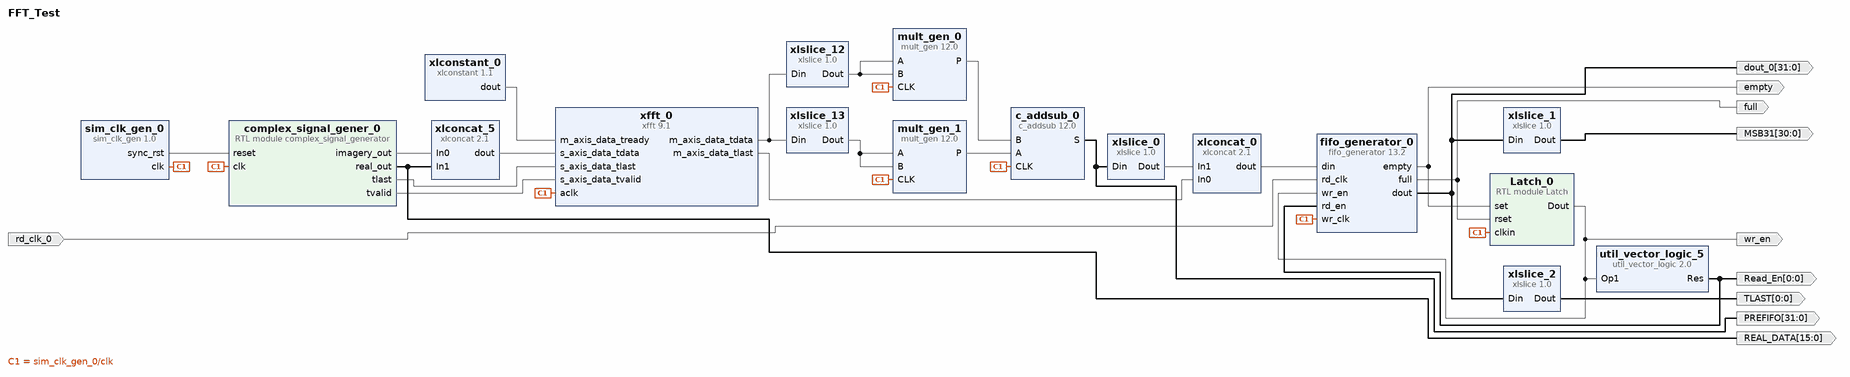
[diagram p0: block diagram of the top level]
# Vivado block design FFT_Test, xczu3eg-sfvc784-1-e, Vivado 2023.1
create_bd_design FFT_Test

create_bd_port -dir O -from 15 -to 0 REAL_DATA
create_bd_port -dir O -from 31 -to 0 dout_0
create_bd_port -dir O -from 0 -to 0 Read_En
create_bd_port -dir O wr_en
create_bd_port -dir O full
create_bd_port -dir O -from 31 -to 0 -type data PREFIFO
create_bd_port -dir O empty
create_bd_port -dir I -type clk rd_clk_0
create_bd_port -dir O -from 30 -to 0 MSB31
create_bd_port -dir O -from 0 -to 0 TLAST

create_bd_cell -type ip -vlnv xilinx.com:ip:c_addsub:12.0 c_addsub_0
set_property -dict [list \
  CONFIG.A_Type Signed \
  CONFIG.A_Width 32 \
  CONFIG.B_Type Signed \
  CONFIG.B_Value 00000000000000000000000000000000 \
  CONFIG.B_Width 32 \
  CONFIG.CE false \
  CONFIG.Latency 1 \
  CONFIG.Out_Width 32 \
] [get_bd_cells c_addsub_0]
create_bd_cell -type module -reference complex_signal_generator complex_signal_gener_0
set_property -dict {CONFIG.FFT_Size 2048 CONFIG.FUNC_TYPE 1} [get_bd_cells complex_signal_gener_0]
create_bd_cell -type ip -vlnv xilinx.com:ip:mult_gen:12.0 mult_gen_0
set_property -dict [list \
  CONFIG.PortAType Signed \
  CONFIG.PortAWidth 16 \
  CONFIG.PortBType Signed \
  CONFIG.PortBWidth 16 \
] [get_bd_cells mult_gen_0]
create_bd_cell -type ip -vlnv xilinx.com:ip:mult_gen:12.0 mult_gen_1
set_property -dict [list \
  CONFIG.PortAType Signed \
  CONFIG.PortAWidth 16 \
  CONFIG.PortBType Signed \
  CONFIG.PortBWidth 16 \
] [get_bd_cells mult_gen_1]
create_bd_cell -type ip -vlnv xilinx.com:ip:sim_clk_gen:1.0 sim_clk_gen_0
create_bd_cell -type ip -vlnv xilinx.com:ip:xfft:9.1 xfft_0
set_property -dict [list \
  CONFIG.channels 1 \
  CONFIG.implementation_options automatically_select \
  CONFIG.input_width 16 \
  CONFIG.number_of_stages_using_block_ram_for_data_and_phase_factors 4 \
  CONFIG.output_ordering natural_order \
  CONFIG.phase_factor_width 16 \
  CONFIG.scaling_options scaled \
  CONFIG.target_clock_frequency 100 \
  CONFIG.target_data_throughput 100 \
  CONFIG.transform_length 2048 \
] [get_bd_cells xfft_0]
create_bd_cell -type ip -vlnv xilinx.com:ip:xlconcat:2.1 xlconcat_5
set_property -dict {CONFIG.IN0_WIDTH 16 CONFIG.IN1_WIDTH 16} [get_bd_cells xlconcat_5]
create_bd_cell -type ip -vlnv xilinx.com:ip:xlslice:1.0 xlslice_12
set_property -dict {CONFIG.DIN_FROM 31 CONFIG.DIN_TO 16} [get_bd_cells xlslice_12]
create_bd_cell -type ip -vlnv xilinx.com:ip:xlslice:1.0 xlslice_13
set_property -dict {CONFIG.DIN_FROM 15 CONFIG.DIN_TO 0} [get_bd_cells xlslice_13]
create_bd_cell -type ip -vlnv xilinx.com:ip:fifo_generator:13.2 fifo_generator_0
set_property -dict [list \
  CONFIG.Enable_ECC false \
  CONFIG.Fifo_Implementation Independent_Clocks_Builtin_FIFO \
  CONFIG.Input_Data_Width 32 \
  CONFIG.Input_Depth 4096 \
  CONFIG.Performance_Options Standard_FIFO \
  CONFIG.Read_Clock_Frequency 10 \
  CONFIG.Write_Clock_Frequency 100 \
  CONFIG.asymmetric_port_width false \
  CONFIG.enable_low_latency false \
] [get_bd_cells fifo_generator_0]
create_bd_cell -type ip -vlnv xilinx.com:ip:util_vector_logic:2.0 util_vector_logic_5
set_property -dict {CONFIG.C_OPERATION not CONFIG.C_SIZE 1} [get_bd_cells util_vector_logic_5]
create_bd_cell -type module -reference Latch Latch_0
create_bd_cell -type ip -vlnv xilinx.com:ip:xlconstant:1.1 xlconstant_0
create_bd_cell -type ip -vlnv xilinx.com:ip:xlconcat:2.1 xlconcat_0
set_property -dict {CONFIG.IN0_WIDTH 1 CONFIG.IN1_WIDTH 31} [get_bd_cells xlconcat_0]
create_bd_cell -type ip -vlnv xilinx.com:ip:xlslice:1.0 xlslice_0
set_property -dict {CONFIG.DIN_FROM 31 CONFIG.DIN_TO 1} [get_bd_cells xlslice_0]
create_bd_cell -type ip -vlnv xilinx.com:ip:xlslice:1.0 xlslice_1
set_property -dict {CONFIG.DIN_FROM 31 CONFIG.DIN_TO 1} [get_bd_cells xlslice_1]
create_bd_cell -type ip -vlnv xilinx.com:ip:xlslice:1.0 xlslice_2
set_property -dict {CONFIG.DIN_FROM 0 CONFIG.DIN_TO 0} [get_bd_cells xlslice_2]

# ---- connections ----

connect_bd_net -net Latch_0_output [get_bd_pins Latch_0/Dout] \
  [get_bd_pins fifo_generator_0/wr_en] [get_bd_pins util_vector_logic_5/Op1] [get_bd_ports wr_en]
connect_bd_net [get_bd_pins xfft_0/m_axis_data_tdata] [get_bd_pins xlslice_12/Din] [get_bd_pins xlslice_13/Din]
connect_bd_net [get_bd_pins xlslice_12/Dout] [get_bd_pins mult_gen_0/A] [get_bd_pins mult_gen_0/B]
connect_bd_net [get_bd_pins xlslice_13/Dout] [get_bd_pins mult_gen_1/A] [get_bd_pins mult_gen_1/B]
connect_bd_net [get_bd_pins c_addsub_0/S] [get_bd_ports PREFIFO] [get_bd_pins xlslice_0/Din]
connect_bd_net [get_bd_pins complex_signal_gener_0/imagery_out] [get_bd_pins xlconcat_5/In0]
connect_bd_net [get_bd_pins complex_signal_gener_0/real_out] [get_bd_pins xlconcat_5/In1] [get_bd_ports REAL_DATA]
connect_bd_net [get_bd_pins complex_signal_gener_0/tlast] [get_bd_pins xfft_0/s_axis_data_tlast]
connect_bd_net [get_bd_pins complex_signal_gener_0/tvalid] [get_bd_pins xfft_0/s_axis_data_tvalid]
connect_bd_net [get_bd_pins fifo_generator_0/dout] [get_bd_ports dout_0] [get_bd_pins xlslice_1/Din] [get_bd_pins xlslice_2/Din]
connect_bd_net [get_bd_pins fifo_generator_0/empty] [get_bd_pins Latch_0/set] [get_bd_ports empty]
connect_bd_net [get_bd_pins fifo_generator_0/full] [get_bd_pins Latch_0/rset] [get_bd_ports full]
connect_bd_net [get_bd_pins mult_gen_0/P] [get_bd_pins c_addsub_0/B]
connect_bd_net [get_bd_pins mult_gen_1/P] [get_bd_pins c_addsub_0/A]
connect_bd_net -net rd_clk_0_1 [get_bd_ports rd_clk_0] [get_bd_pins fifo_generator_0/rd_clk]
connect_bd_net [get_bd_pins sim_clk_gen_0/clk] \
  [get_bd_pins complex_signal_gener_0/clk] [get_bd_pins xfft_0/aclk] [get_bd_pins mult_gen_0/CLK] \
  [get_bd_pins mult_gen_1/CLK] [get_bd_pins c_addsub_0/CLK] [get_bd_pins Latch_0/clkin] [get_bd_pins fifo_generator_0/wr_clk]
connect_bd_net [get_bd_pins sim_clk_gen_0/sync_rst] [get_bd_pins complex_signal_gener_0/reset]
connect_bd_net [get_bd_pins util_vector_logic_5/Res] [get_bd_pins fifo_generator_0/rd_en] [get_bd_ports Read_En]
connect_bd_net [get_bd_pins xfft_0/m_axis_data_tlast] [get_bd_pins xlconcat_0/In0]
connect_bd_net [get_bd_pins xlconcat_0/dout] [get_bd_pins fifo_generator_0/din]
connect_bd_net [get_bd_pins xlconcat_5/dout] [get_bd_pins xfft_0/s_axis_data_tdata]
connect_bd_net [get_bd_pins xlconstant_0/dout] [get_bd_pins xfft_0/m_axis_data_tready]
connect_bd_net [get_bd_pins xlslice_0/Dout] [get_bd_pins xlconcat_0/In1]
connect_bd_net [get_bd_pins xlslice_1/Dout] [get_bd_ports MSB31]
connect_bd_net [get_bd_pins xlslice_2/Dout] [get_bd_ports TLAST]

validate_bd_design
save_bd_design
